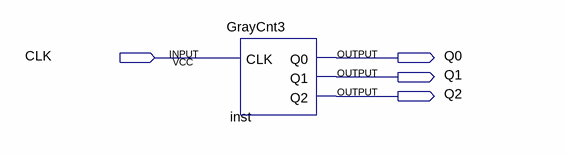
[diagram p0: schematic sheet]
// Quartus schematic Bin2GrayDemo.bdf as structural Verilog: 1 symbols, 4 pins
module Bin2GrayDemo (
  input  CLK,
  output Q0,
  output Q1,
  output Q2
);

  GrayCnt3 inst (.CLK(CLK), .Q0(Q0), .Q1(Q1), .Q2(Q2));
endmodule
